# EAGLE schematic MicroLipoV1.1 (EAGLE 7.6.0)
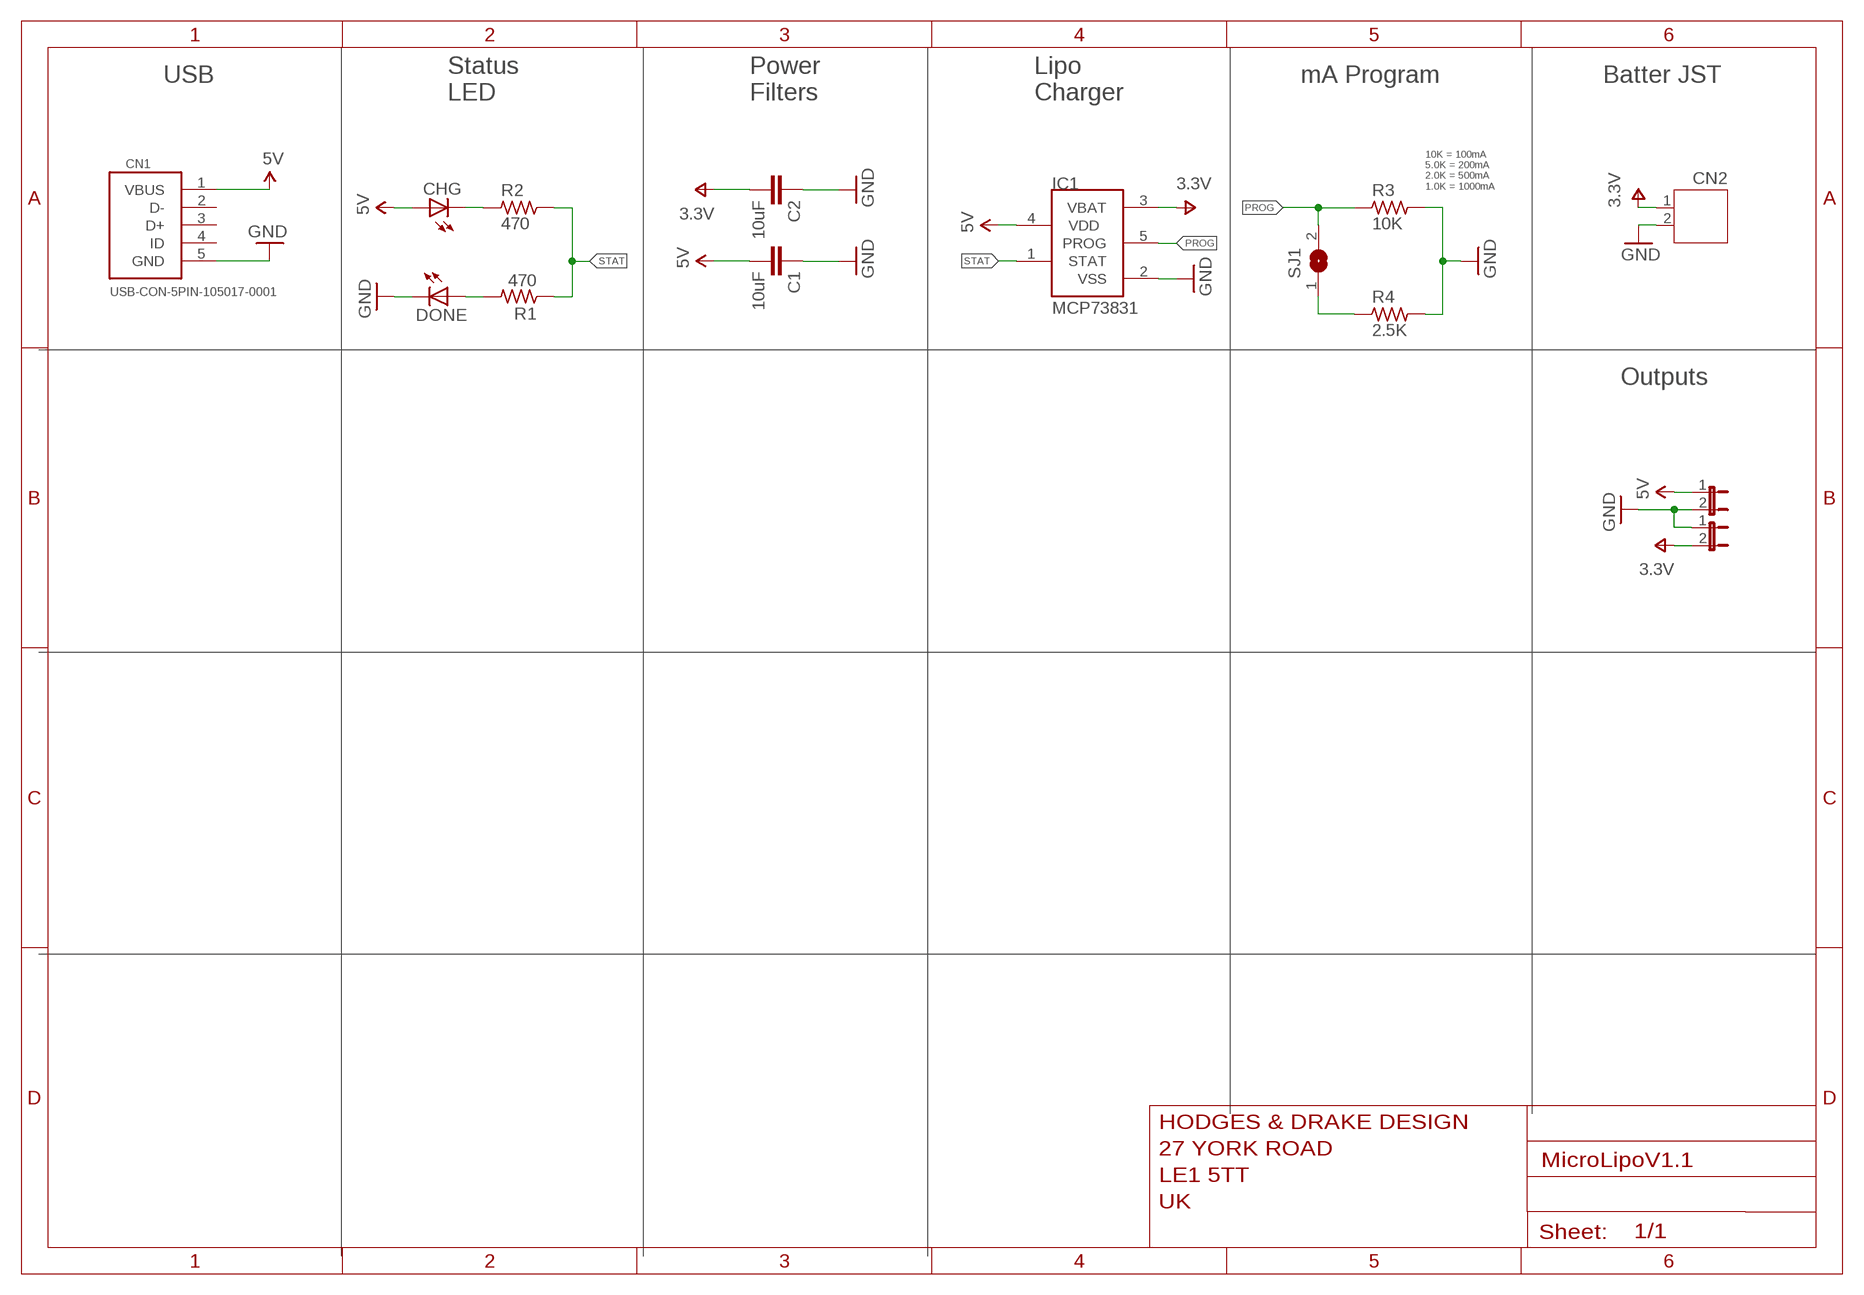
[diagram p0: schematic, sheet 1]

## Parts
C1  10uF  C-EUC0805K  [C0805K]
C2  10uF  C-EUC0805K  [C0805K]
CHG  LEDCHIPLED_0805  [CHIPLED_0805]
CN1  USB-CON-5PIN-105017-0001  [USB-MICRO-MOLEX-105017-0001]
CN2  JST-PH2  [JST-PH2-S2B]
DONE  LEDCHIPLED_0805  [CHIPLED_0805]
IC1  MCP73831  [SOT23-5L]
JP2  JUMPER-2PTH  [1X02]
JP3  JUMPER-2PTH  [1X02]
R1  470  R_0805  [R0805]
R2  470  R_0805  [R0805]
R3  10K  R_0805  [R0805]
R4  2.5K  R_0805  [R0805]
SJ1  SJ  [SJ]

## Nets
5V: C1.2 CHG.A CN1.1(VBUS) IC1.4(VDD) JP2.1
GND: C1.1 C2.1 CN1.5(GND) CN2.2 DONE.C IC1.2(VSS) JP2.2 JP3.1 R3.2 R4.2
N$1: CHG.C R2.1
N$2: DONE.A R1.2
N$3: R4.1 SJ1.1
PROG: IC1.5(PROG) R3.1 SJ1.2
STAT: IC1.1(STAT) R1.1 R2.2
V+: C2.2 CN2.1 IC1.3(VBAT) JP3.2 ; supply symbol labelled 3.3V
Unconnected: CN1.2(D-) CN1.3(D+) CN1.4(ID)

## Notes on the sheet
- USB | mA Program | Batter JST
- Status
  LED
- Power
  Filters
- Lipo
  Charger
- 10K = 100mA
  5.0K = 200mA
  2.0K = 500mA
  1.0K = 1000mA
- Outputs

## Library data of the parts
C1 C2 = rcl:C-EU: CAPACITOR, European symbol
CHG DONE = adafruit:LED: LED OSRAM: - CHIPLED LG R971, LG N971, LY N971, LG Q971, LY Q971, LO R971, LY R971 LH N974, LH R974 LS Q976, LO Q976, LY Q976 LO Q996 - Hyper CHIPLED LW Q18S LB Q993, LB Q99A, LB R99A - SideLED LS A670, LO A670, LY A670, LG A670, LP A670 LB A673, LV A673, LT A673, LW A673 LH A674 LY A675 LS A676, LA A676, LO A676, LY A676, LW A676 LS A679, LY A679, LG A679 - Hyper Micro SIDELED® LS Y876, LA Y876, LO Y876, LY Y876 LT Y87S - SmartLED LW L88C, LW L88S LB L89C, LB L89S, LG L890 LS L89K, LO L89K, LY L89K LS L896, LA L896, LO L896, LY L896 - TOPLED LS T670, LO T670, LY T670, LG T670, LP T670 LSG T670, LSP T670, LSY T670, LOP T670, LYG T670 LG T671, LOG T671, LSG T671 LB T673, LV T673, LT T673, LW T673 LH T674 LS T676, LA T676, LO T676, LY T676, LB T676, LH T676, LSB T676, LW T676 LB T67C, LV T67C, LT T67C, LS T67K, LO T67K, LY T67K, LW E67C LS E67B, LA E67B, LO E67B, LY E67B, LB E67C, LV E67C, LT E67C LW T67C LS T679, LY T679, LG T679 LS T770, LO T770, LY T770, LG T770, LP T770 LB T773, LV T773, LT T773, LW T773 LH T774 LS E675, LA E675, LY E675, LS T675 LS T776, LA T776, LO T776, LY T776, LB T776 LHGB T686 LT T68C, LB T68C - Hyper Mini TOPLED® LB M676 - Mini TOPLED Santana® LG M470 LS M47K, LO M47K, LY M47K Source: http://www.osram.convergy.de/
CN1 = GeekAmmo:USB-CON-5PIN: Molex Micro USB 105017-0001
CN2 = con-jst-ph:JST-PH2
IC1 = microchip-update-2:MCP73831: Miniature Single-Cell, Fully Integrated Li-Ion, Li-Polymer Charge Management Controllers
JP2 JP3 = SparkFun:JUMPER-2: Jumper Basic 0.1" spaced jumper. Use with breakaway headers.
R1-R4 = rc-master-smd:R_: RESISTOR
SJ1 = jumper:SJ: SMD solder JUMPER